# EAGLE design USB To Uart_5V_3V3 v1 (EAGLE 6.4)
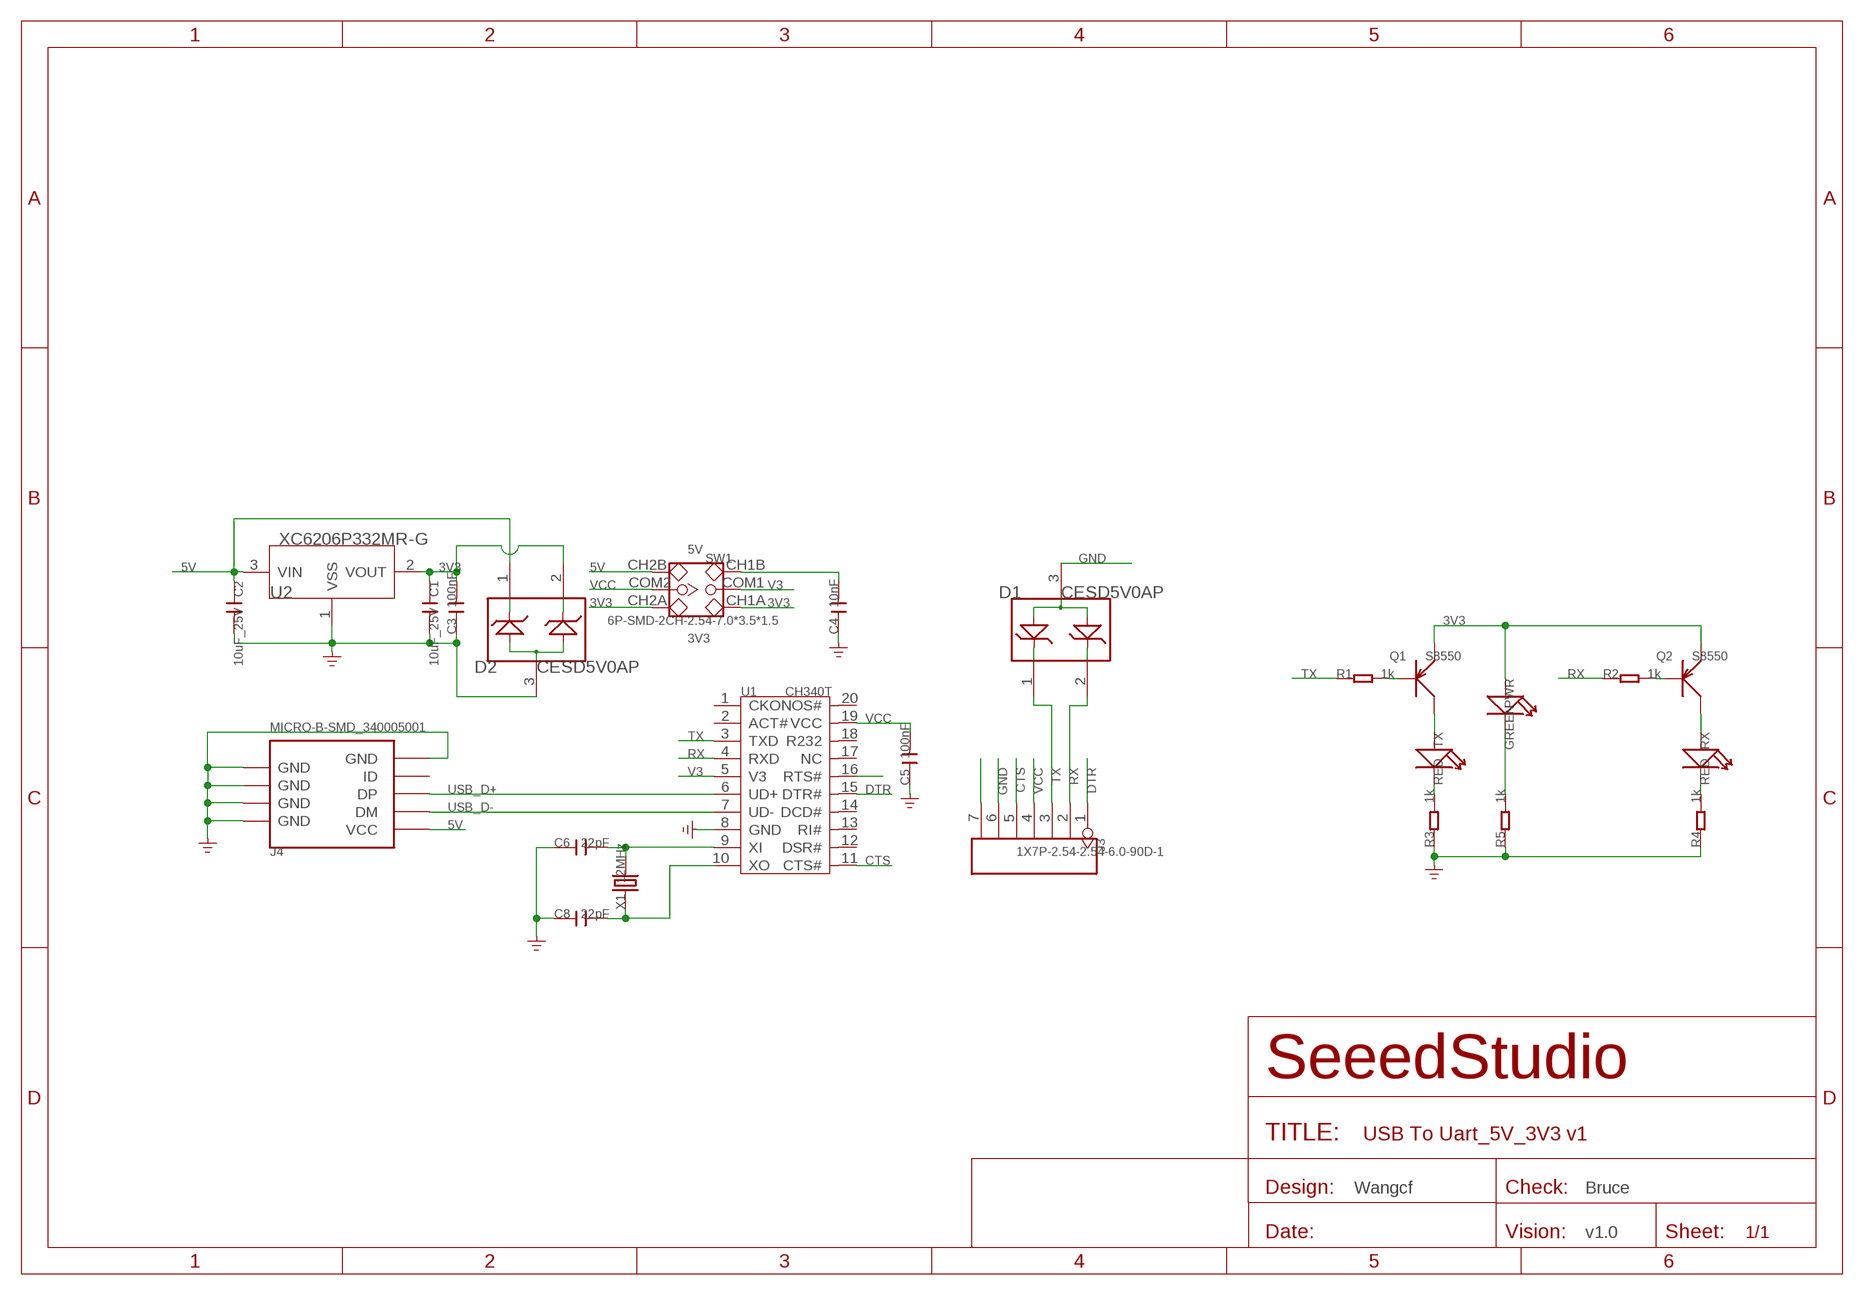
[diagram p0: schematic, sheet 1]

## Parts
C1  10uF_25V  C-0805  [C0805]
C2  10uF_25V  C-0805  [C0805]
C3  100nF  C-0402  [C0402]
C4  10nF  C-0402  [C0402]
C5  100nF  C-0402  [C0402]
C6  22pF  C-0402  [C0402]
C8  22pF  C-0402  [C0402]
D1  CESD5V0AP  D-ESD-3P  [SOT23]
D2  CESD5V0AP  D-ESD-3P  [SOT23]
J3  1X7P-2.54-2.54-6.0-90D-1  HEADER-7P  [7P-2.54-65/35MIL]
J4  MICRO-B-SMD_340005001  USB-MINIUSB-5P-MICRO  [MICRO-USB]
PWR  GREEN  LED'0603'  [LED-0603]
Q1  S8550  TRANSISTOR-PNP-SOT23  [SOT23]
Q2  S8550  TRANSISTOR-PNP-SOT23  [SOT23]
R1  1k  R-0402  [R0402]
R2  1k  R-0402  [R0402]
R3  1k  R-0402  [R0402]
R4  1k  R-0402  [R0402]
R5  1k  R-0402  [R0402]
RX  RED  LED'0603'  [LED-0603]
SW1  6P-SMD-2CH-2.54-7.0*3.5*1.5  SWITCH-2CH-6P-SMD  [6P-SMD-2CH-2.54-3.5X7.2]
TX  RED  LED'0603'  [LED-0603]
U1  CH340T  [SSOP20]
U2  XC6206P332MR-G  XC6206MR  [SOT23]
X1  12MHz  CRYSTAL'5032'  [2P-SMD-5X3.2]

## Nets
3V3: C1.1 C3.2 D2.2 PWR.+ Q1.2(E) Q2.2(E) SW1.CH1A SW1.CH2A U2.2(VOUT)
5V: C2.1 D2.1 J4.1(VCC) SW1.CH2B U2.3(VIN)
CTS: J3.5 U1.11(CTS#)
DTR: J3.1 U1.15(DTR#)
GND: C1.2 C2.2 C3.1 C4.1 C5.1 C6.1 C8.1 D1.3 D2.3 J3.6 J4.5(GND) J4.S1(GND) J4.S2(GND) J4.S3(GND) J4.S4(GND) J4.S5(GND) J4.S6(GND) R3.1 R4.1 R5.1 U1.8(GND) U2.1(VSS)
N$1: Q1.3(C) TX.+
N$2: Q2.3(C) RX.+
N$3: J3.7 U1.16(RTS#)
N$4: C6.2 U1.9(XI) X1.2
N$5: C8.2 U1.10(XO) X1.1
N$6: R3.2 TX.-
N$7: Q1.1(B) R1.2
N$8: Q2.1(B) R2.2
N$9: C4.2 SW1.CH1B
N$10: R4.2 RX.-
N$12: PWR.- R5.2
RX: D1.2 J3.2 R2.1 U1.4(RXD)
TX: D1.1 J3.3 R1.1 U1.3(TXD)
USB_D+: J4.3(DP) U1.6(UD+)
USB_D-: J4.2(DM) U1.7(UD-)
V3: SW1.COM1 U1.5(V3)
VCC: C5.2 J3.4 SW1.COM2 U1.19(VCC)
Unconnected: J4.4(ID) U1.1(CKO) U1.2(ACT#) U1.12(DSR#) U1.13(RI#) U1.14(DCD#) U1.17(NC) U1.18(R232) U1.20(NOS#)

## Notes on the sheet
- 5V
- 3V3
- Wangcf | Bruce
- v1.0

## Library data of the parts
C1-C6 C8 = Discrete:C*: Ceramic Capacitors
D1 D2 = Discrete:D-ESD-3P
J3 = Connector :HEADER-7P
J4 = Connector :USB-MINIUSB-5P
PWR RX TX = Discrete:LED*
Q1 Q2 = Discrete:TRANSISTOR-PNP*: PNP audion
R1-R5 = Discrete:R*
SW1 = Discrete:SWITCH-2CH-6P
U1 = template:CH340T
U2 = IC:XC6206: LOW ESR Cap.Compatible Positive Voltage Regulators
X1 = Discrete:CRYSTAL*: CRYSTAL

## Net classes
0 default: width 0.152 mm, drill 0.305 mm, clearance 0.152 mm

## Board
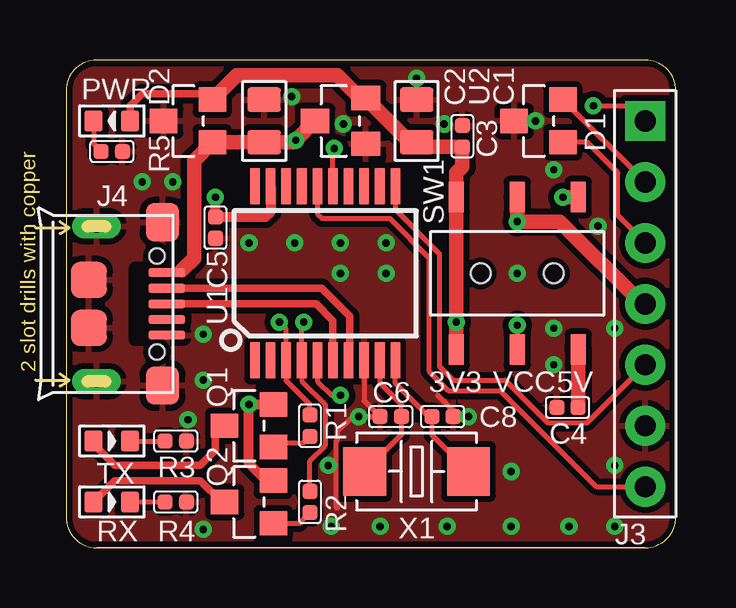
[diagram p1: board, top side]
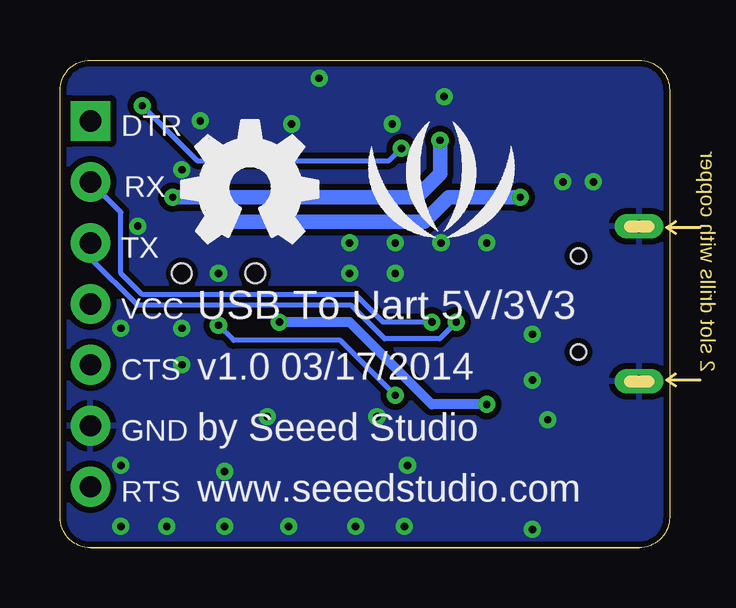
[diagram p2: board, bottom side, seen from below]

Size 25.4 x 20.32 mm. Coordinates in mm from the lower left corner, seen from the top.
Outline: 0,19.05 0,1.27
Outline: 0,1.27 arc90 1.27,0
Outline: 1.27,0 24.13,0
Outline: 24.13,0 arc90 25.4,1.27
Outline: 25.4,1.27 25.4,19.05
Outline: 25.4,19.05 arc90 24.13,20.32
Outline: 24.13,20.32 1.27,20.32
Outline: 1.27,20.32 arc90 0,19.05
Outline: 0,19.05 0,1.27
Outline: 0,1.27 arc90 1.27,0
Outline: 24.13,0 arc90 25.4,1.27
Outline: 25.4,1.27 25.4,19.05
Outline: 25.4,19.05 arc90 24.13,20.32
Outline: 24.13,20.32 1.27,20.32
Outline: 1.27,20.32 arc90 0,19.05
Outline: 24.13,0 1.27,0
Copper layers (1*16): Top 0.035mm / dielectric 1.5mm / Bottom 0.035mm
Design rules "default *": minimum track width 8mil, minimum drill 12mil, track to track 8mil, track to pad 8mil, pad to pad 8mil, via to via 8mil, smd to smd 0mil, copper to edge 8mil, drill to drill 8mil, minimum pad ring 10mil, minimum via ring 8mil, stop-mask expansion 4mil, vias tented up to drill 25mil, thermal gap 10mil

### Footprints (pad centres in the part's own frame; a part is rotated, then mirrored left to right if it is on the bottom)
C0805 = smd 1.016 x 1.397: 1 -0.889,0; 2 0.889,0
C0402 = smd 0.635 x 0.635: 1 -0.445,0; 2 0.445,0
SOT23 = smd 1.016 x 1.143: 1 -0.889,-1.016; 2 0.889,-1.016; 3 0,1.016
7P-2.54-65/35MIL = drill 0.889 pad 1.651 square: 1 0,7.62 | drill 0.889 pad 1.651: 2 0,5.08; 3 0,2.54; 4 0,0; 5 0,-2.54; 6 0,-5.08; 7 0,-7.62
MICRO-USB = smd 0.381 x 1.524: 1 -1.3,-0.25; 2 -0.65,-0.25; 3 0,-0.25; 4 0.65,-0.25; 5 1.3,-0.25 | smd 1.6 x 1.397: S1 -3.4,-0.427; S6 3.4,-0.427 | drill 0.508 pad 1.016 long: S2 -3.226,-3.175; S5 3.226,-3.175 | smd 1.5 x 1.5: S3 -1,-3.5; S4 1,-3.5 | hole 0.635: -2,-0.65; 2,-0.65
LED-0603 = smd 0.762 x 0.889: + -0.762,0; - 0.762,0
R0402 = smd 0.635 x 0.635: 1 -0.445,0; 2 0.445,0
6P-SMD-2CH-2.54-3.5X7.2 = smd 1.27 x 0.635: CH1A -3.175,2.54; CH1B -3.175,-2.54; CH2A 3.175,2.54; CH2B 3.175,-2.54; COM1 -3.175,0; COM2 3.175,0 | hole 0.813: 0,1.524; 0,-1.524
SSOP20 = smd 0.4 x 1.5: 1 -2.925,-3.625; 2 -2.275,-3.625; 3 -1.625,-3.625; 4 -0.975,-3.625; 5 -0.325,-3.625; 6 0.325,-3.625; 7 0.975,-3.625; 8 1.625,-3.625; 9 2.275,-3.625; 10 2.925,-3.625; 11 2.925,3.625; 12 2.275,3.625; 13 1.625,3.625; 14 0.975,3.625; 15 0.325,3.625; 16 -0.325,3.625; 17 -0.975,3.625; 18 -1.625,3.625; 19 -2.275,3.625; 20 -2.925,3.625
SOT23' = smd 1.016 x 1.2: 1 -0.95,-1.06; 2 0.95,-1.06; 3 0,1.06
2P-SMD-5X3.2 = smd 1.778 x 2.032: 1 -2.159,0; 2 2.159,0

### Placement (x,y rotation side)
C1  14.61,17.78 90 top
C2  8.26,17.78 90 top
C3  16.51,17.14 270 top
C4  20.89,5.84 0 top
C5  6.22,13.34 90 top
C6  13.53,5.46 0 top
C8  15.68,5.46 180 top
D1  19.68,17.78 90 top
D2  5.08,17.78 90 top
J3  24.13,10.16 0 top
J4  4.45,10.16 270 top
PWR  1.91,17.78 180 top
Q1  7.62,5.08 90 top
Q2  7.62,1.91 90 top
R1  10.16,5.08 270 top
R2  10.16,1.91 270 top
R3  4.57,4.45 180 top
R4  4.57,1.91 180 top
R5  1.91,16.51 180 top
RX  1.91,1.91 0 top
SW1  18.8,11.43 90 top
TX  1.91,4.45 0 top
U1  10.79,11.43 0 top
U2  XC6206P332MR-G  [SOT23']  11.43,17.78 90 top
U$8  [LOGO_SILK]  9.53,14.61 0 bottom
U$9  [OSHW_FILLX200_NOTEXT]  20.32,12.7 0 bottom
X1  14.61,3.17 180 top

### Tracks (layer width: path | path; a pad name or v marks a point on that pad's centre or on a via)
3V3  (via drill 0.3 pad 0.64)
  Top 0.305: D2.2 5.84,18.92 3.17,18.92 2.67,18.41 PWR.+
  Top 0.406: Q2.2 8.34,2.79 7.62,3.51 v7.62,5.97 Q1.2
  Top 0.61: SW1.CH1A v16.26,9.4 SW1.CH2A 16.26,15.62 16.51,15.88 C3.2 14.8,16.7 C1.1 14.33,16.89 U2.2 12.26,18.73 11.3,19.68 7.11,19.68 D2.2
  Bottom 0.406: v7.62,5.97 9.91,5.97 13.34,9.4 v16.26,9.4
5V  (via drill 0.3 pad 0.64)
  Top 0.203: J4.1 4.73,11.46 4.83,11.56
  Top 0.61: U2.3 v9.57,16.98 9.48,16.89 C2.1 D2.1 5.33,16.13 5.33,12.06 4.83,11.56 | SW1.CH2B v20.7,14.61
  Bottom 0.61: v20.7,14.61 10.54,14.61 9.57,15.58 v9.57,16.98
CTS
  Top 0.203: U1.11 13.72,14.09 15.56,12.26 15.56,7.56 16.13,6.99 18.29,6.99 20.07,5.21 21.72,5.21 J3.5
DTR  (via drill 0.3 pad 0.64)
  Top 0.203: v21.97,18.41 23.5,18.41 J3.1 | U1.15 11.12,16.58 v11.18,16.64
  Bottom 0.203: v11.18,16.64 11.68,16.13 19.68,16.13 v21.97,18.41
GND  (via drill 0.3 pad 0.64)
  Top 0.203: U1.8 12.42,6.12 C6.1 11.94,5.46 11.3,4.83 11.3,4.51 11.24,4.45 11.24,1.71 11.3,1.65 | C8.1 16.13,5.71 15.49,6.35
  other vias: 5.08,5.33 5.71,0.76 12.19,5.46 16.76,5.46 18.54,3.17 18.54,0.89 15.88,0.89 13.08,0.89 11.05,0.89 10.92,3.43 22.86,3.43 22.86,0.89 18.8,11.43 22.16,13.4 13.34,11.43 11.43,11.43 9.53,12.7 7.62,12.7 5.71,8.89 5.71,6.99 4.45,15.24 9.4,18.8 14.61,19.56 15.75,17.65 19.56,17.78 20.32,15.75 3.17,15.24 20.95,0.89 11.56,17.65 20.32,7.62 20.32,9.14 22.86,9.14 11.43,12.7 13.34,12.7
  pour Top (isolate 0.254): 0,20.32 25.4,20.32 25.4,0 0,0
  pour Bottom (isolate 0.254): 0,20.32 25.4,20.32 25.4,0 0,0
N$1
  Top 0.305: TX.+ 1.14,4.32 2.03,3.43 5.59,3.43 6.22,4.06 6.22,4.7 Q1.3
N$2
  Top 0.305: Q2.3 6.48,1.91 5.59,2.79 2.03,2.79 RX.+
N$3
  Top 0.203: U1.16 10.47,13.91 10.67,13.72 13.49,13.72 15.11,12.09 15.11,7.36 15.93,6.54 18.1,6.54 22.1,2.54 J3.7
N$4
  Top 0.203: U1.9 13.08,6.86 13.97,5.97 C6.2 13.97,4.7 X1.2
N$5
  Top 0.203: U1.10 13.72,6.86 15.11,5.46 C8.2 15.24,4.7 X1.1
N$6
  Top 0.203: TX.- R3.2
N$7
  Top 0.203: 8.83,4.38 9.91,4.38 R1.2
  Top 0.305: 8.83,4.38 Q1.1
N$8
  Top 0.203: Q2.1 9.72,1.02 R2.2
N$9
  Top 0.61: 21.34,8.38 SW1.CH1B C4.2
N$10
  Top 0.203: RX.- R4.2
N$12
  Top 0.203: PWR.- 1.14,16.83 R5.2
RX  (via drill 0.3 pad 0.64)
  Top 0.203: v9.91,9.4 9.82,9.31 U1.4 9.82,6.94 10.79,5.97 10.79,4.25 10.16,3.62 R2.1 | D1.2 J3.2
  Bottom 0.203: v9.91,9.4 11.94,9.4 13.08,10.54 21.97,10.54 22.86,11.43 22.86,13.97 J3.2
TX  (via drill 0.3 pad 0.64)
  Top 0.203: v8.89,9.4 9.17,9.12 U1.3 9.17,6.96 10.16,5.97 R1.1 | D1.1 21.72,16.89 22.99,15.62 22.99,13.84 J3.3
  Bottom 0.203: v8.89,9.4 9.59,8.7 11.88,8.7 13.27,10.1 22.16,10.1 24.13,12.06 J3.3
USB_D+
  Top 0.305: U1.6 11.12,9.45 10.41,10.16 J4.3
USB_D-
  Top 0.305: J4.2 10.65,10.81 11.81,9.65 11.81,7.85 U1.7
V3  (via drill 0.3 pad 0.64)
  Top 0.203: U1.5 10.47,6.94 11.06,6.35 v11.43,6.35 | v18.8,9.27 SW1.COM1
  Bottom 0.203: v11.43,6.35 13.72,8.64 18.16,8.64 v18.8,9.27
VCC  (via drill 0.3 pad 0.64)
  Top 0.406: v6.22,14.61 C5.2 8.32,13.78 8.52,13.98 U1.19
  Top 0.61: SW1.COM2 v18.8,13.59 20.57,13.59 24,10.16 J3.4
  Bottom 0.61: v18.8,13.59 10.22,13.59 9.21,14.61 v6.22,14.61

### Text on the board
tPlace: 3V3 | VCC | 5V
bPlace: DTR | RX | TX | USB To Uart 5V/3V3 | VCC | v1.0 03/17/2014 | CTS | by Seeed Studio | GND | www.seeedstudio.com | RTS